# Altium schematic sheet S7CAS-PLEIADES-CARTE-MERE_P01_ETHERNET.SchDoc
size Tabloid; DocumentNumber: 5; SheetNumber: 5; SheetTotal: 17; Sheet_Name: ETHERNET; Size: 11x17
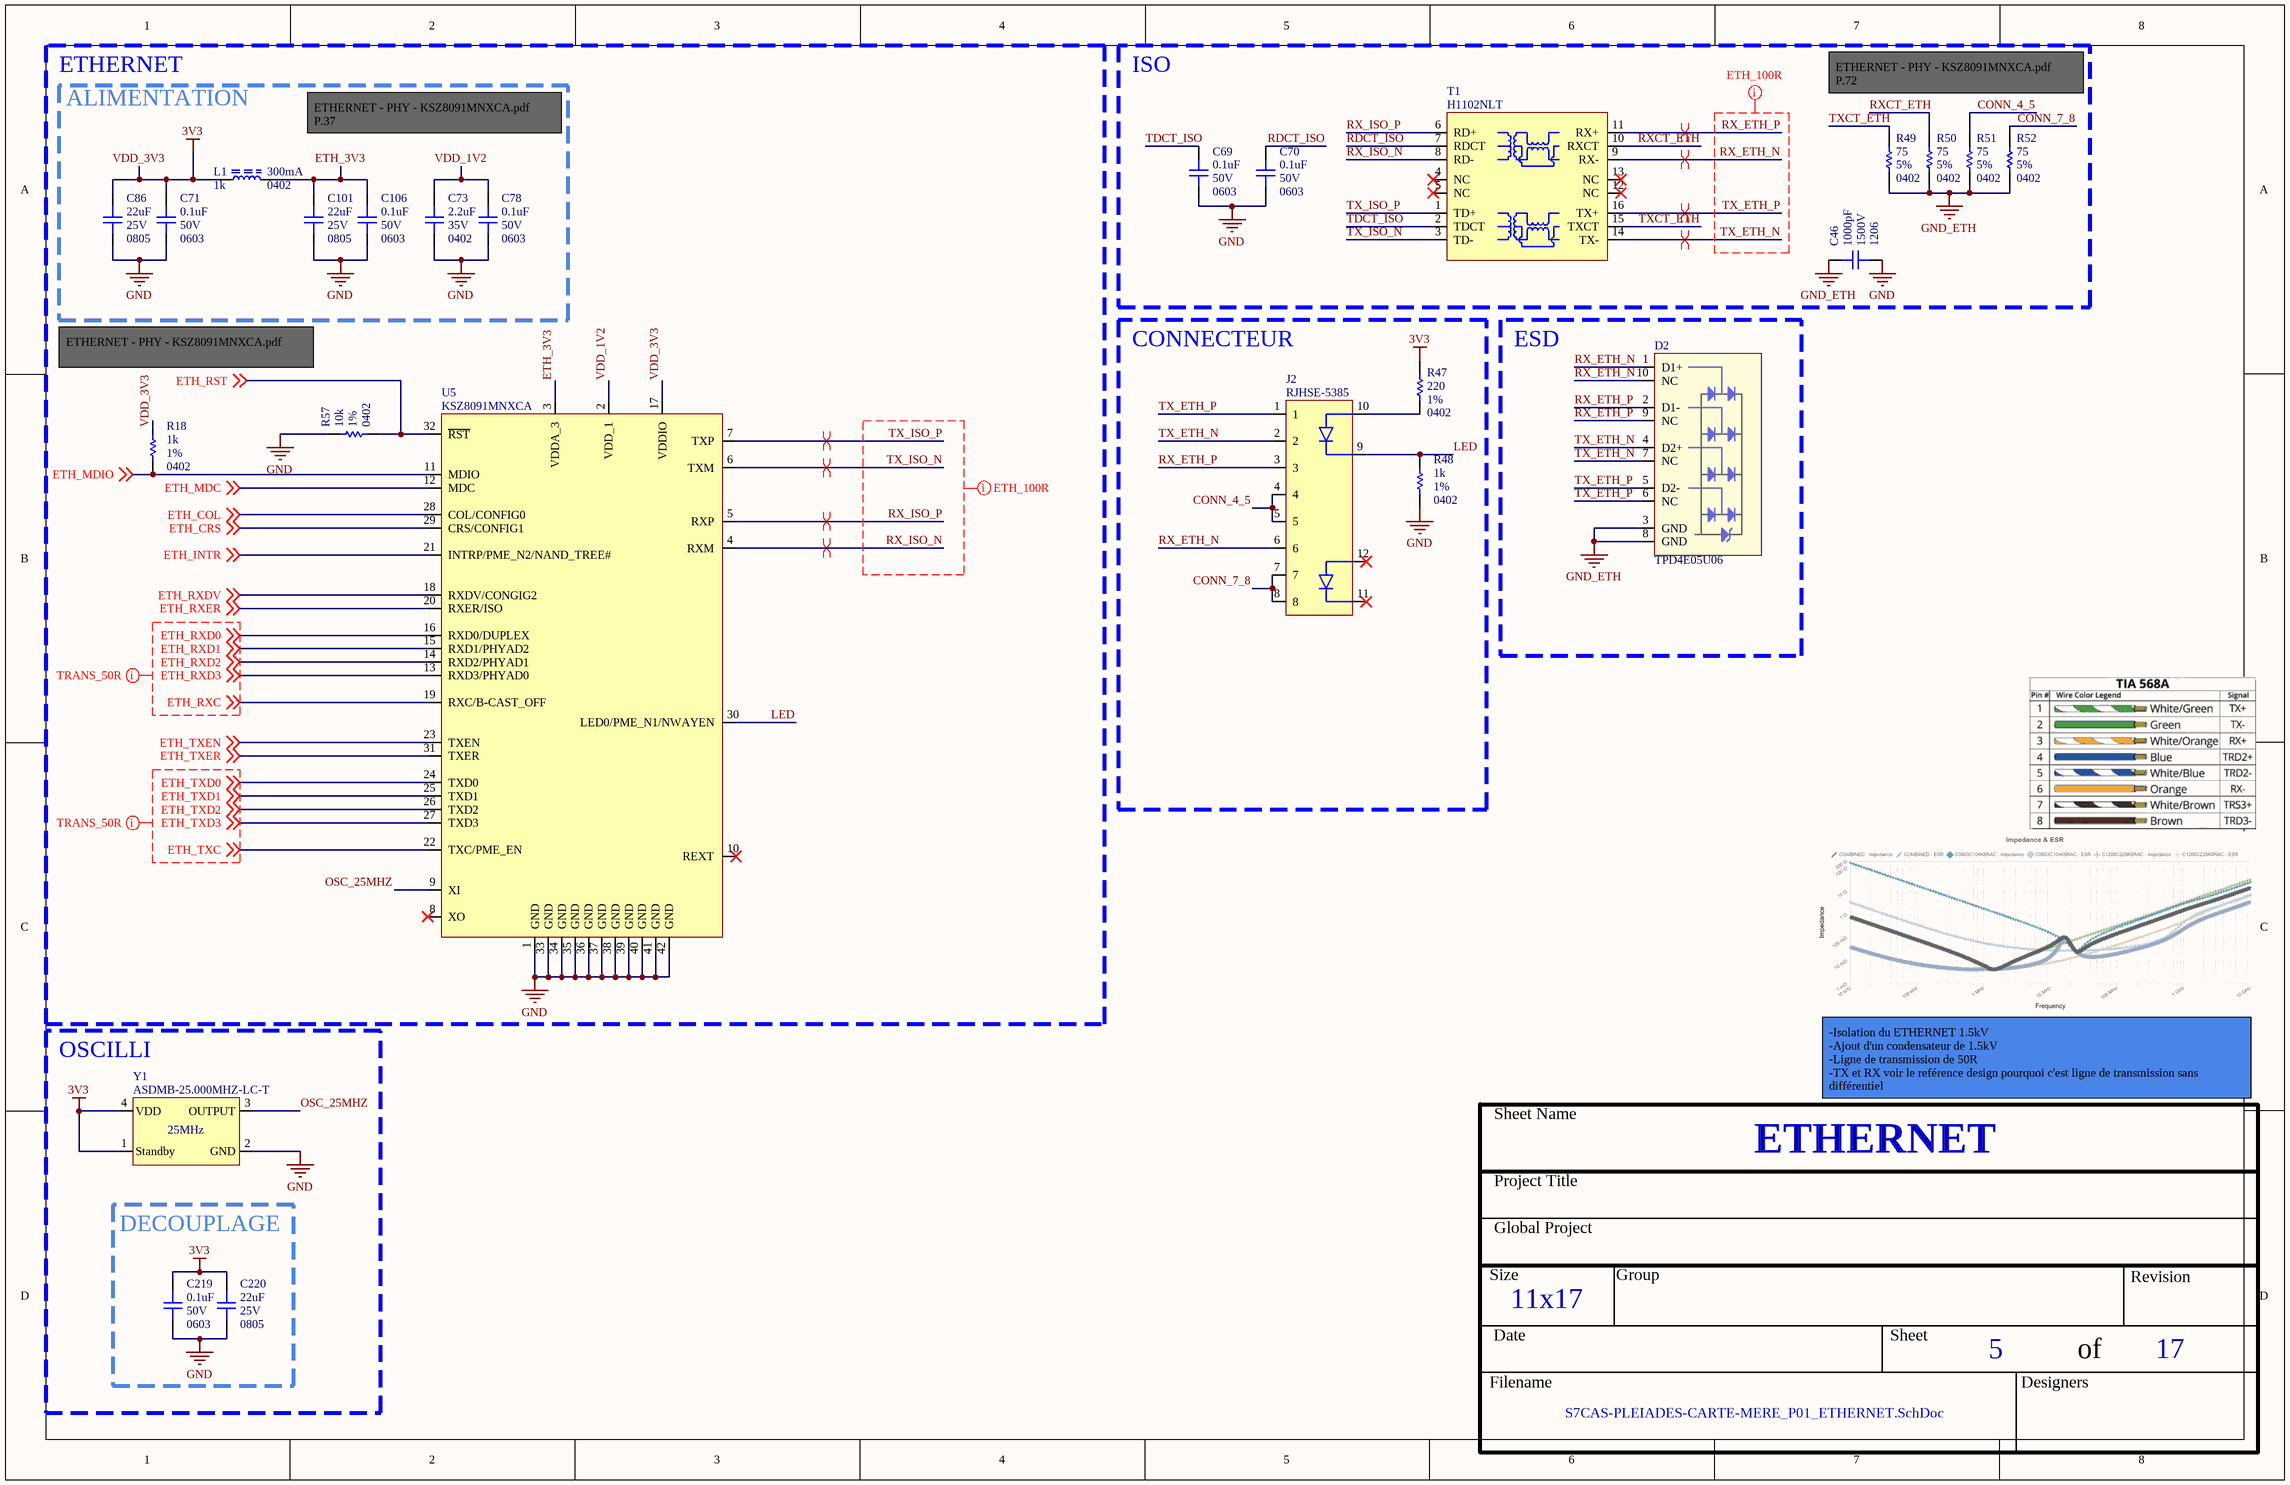
[diagram p0: S7CAS-PLEIADES-CARTE-MERE_P01_ETHERNET.SchDoc]

## Parts
C46  value 1000pF  Voltage: 1500V  Package: 1206  [CAP_1206]  (hidden comment: CAP - 1206)
C69  value 0.1uF  Voltage: 50V  Package: 0603  [CAP_0603]  (hidden comment: CAP - 0603)
C70  value 0.1uF  Voltage: 50V  Package: 0603  [CAP_0603]  (hidden comment: CAP - 0603)
C71  value 0.1uF  Voltage: 50V  Package: 0603  [CAP_0603]  (hidden comment: CAP - 0603)
C73  value 2.2uF  Voltage: 35V  Package: 0402  [CAP_0402]  (hidden comment: CAP - 0402)
C78  value 0.1uF  Voltage: 50V  Package: 0603  [CAP_0603]  (hidden comment: CAP - 0603)
C86  value 22uF  Voltage: 25V  Package: 0805  [CAP_0805]  (hidden comment: CAP - 0805)
C101  value 22uF  Voltage: 25V  Package: 0805  [CAP_0805]  (hidden comment: CAP - 0805)
C106  value 0.1uF  Voltage: 50V  Package: 0603  [CAP_0603]  (hidden comment: CAP - 0603)
C219  value 0.1uF  Voltage: 50V  Package: 0603  [CAP_0603]  (hidden comment: CAP - 0603)
C220  value 22uF  Voltage: 25V  Package: 0805  [CAP_0805]  (hidden comment: CAP - 0805)
D2  TPD4E05U06  [TVS_DATA_TPD4E05U06]
J2  RJHSE-5385  [CONN_ETHERNET_RJHSE-5385]
L1  value 1k  Current: 300mA  Package: 0402  [FER_0402]  (hidden comment: FER - 0402)
R18  value 1k  Package: 0402  Precision: 1%  [RES_0402]  (hidden comment: RES - 0402)
R47  value 220  Package: 0402  Precision: 1%  [RES_0402]  (hidden comment: RES - 0402)
R48  value 1k  Package: 0402  Precision: 1%  [RES_0402]  (hidden comment: RES - 0402)
R49  value 75  Package: 0402  Precision: 5%  [RES_0402]  (hidden comment: RES - 0402)
R50  value 75  Package: 0402  Precision: 5%  [RES_0402]  (hidden comment: RES - 0402)
R51  value 75  Package: 0402  Precision: 5%  [RES_0402]  (hidden comment: RES - 0402)
R52  value 75  Package: 0402  Precision: 5%  [RES_0402]  (hidden comment: RES - 0402)
R57  value 10k  Package: 0402  Precision: 1%  [RES_0402]  (hidden comment: RES - 0402)
T1  H1102NLT  [TRANSFO_H1102NLT]
U5  KSZ8091MNXCA  [COM_ETH_PHY_KSZ8091MNXCA]
Y1  ASDMB-25.000MHZ-LC-T  [OSC_ASDMB-25.000MHZ-LC-T]

## Blocks framed on the sheet
ISO: C46 C69 C70 R49-R52 T1
CONNECTEUR: J2 R47 R48
ESD: D2
OSCILLI: Y1
DECOUPLAGE: C219 C220

## Nets
GND: C46.1 C69.1 C70.1 C71.1 C73.1 C78.1 C86.1 C101.1 C106.1 C219.1 C220.1 R48.1 R57.1 U5.1(GND) U5.33(GND) U5.34(GND) U5.35(GND) U5.36(GND) U5.37(GND) U5.38(GND) U5.39(GND) U5.40(GND) U5.41(GND) U5.42(GND) Y1.2(GND)
GND_ETH: C46.2 D2.3(GND) D2.8(GND) R49.1 R50.1 R51.1 R52.1
VDD_3V3: C71.2 C86.2 C219.2 C220.2 L1.2 R18.2 R47.2 U5.17(VDDIO) Y1.1(Standby) Y1.4(VDD)  [also labelled 3V3]
CONN_4_5: J2.4 J2.5 R51.2
CONN_7_8: J2.7 J2.8 R52.2
ETH_3V3: C101.2 C106.2 L1.1 U5.3(VDDA_3)
ETH_COL: U5.28(COL/CONFIG0) ; off-sheet ETH_COL
ETH_CRS: U5.29(CRS/CONFIG1) ; off-sheet ETH_CRS
ETH_INTR: U5.21(INTRP/PME_N2/NAND_TREE#) ; off-sheet ETH_INTR
ETH_MDC: U5.12(MDC) ; off-sheet ETH_MDC
ETH_MDIO: R18.1 U5.11(MDIO) ; off-sheet ETH_MDIO
ETH_RST: R57.2 U5.32(~{RST}) ; off-sheet ETH_RST
ETH_RXC: U5.19(RXC/B-CAST_OFF) ; off-sheet ETH_RXC
ETH_RXD0: U5.16(RXD0/DUPLEX) ; off-sheet ETH_RXD0
ETH_RXD1: U5.15(RXD1/PHYAD2) ; off-sheet ETH_RXD1
ETH_RXD2: U5.14(RXD2/PHYAD1) ; off-sheet ETH_RXD2
ETH_RXD3: U5.13(RXD3/PHYAD0) ; off-sheet ETH_RXD3
ETH_RXDV: U5.18(RXDV/CONGIG2) ; off-sheet ETH_RXDV
ETH_RXER: U5.20(RXER/ISO) ; off-sheet ETH_RXER
ETH_TXC: U5.22(TXC/PME_EN) ; off-sheet ETH_TXC
ETH_TXD0: U5.24(TXD0) ; off-sheet ETH_TXD0
ETH_TXD1: U5.25(TXD1) ; off-sheet ETH_TXD1
ETH_TXD2: U5.26(TXD2) ; off-sheet ETH_TXD2
ETH_TXD3: U5.27(TXD3) ; off-sheet ETH_TXD3
ETH_TXEN: U5.23(TXEN) ; off-sheet ETH_TXEN
ETH_TXER: U5.31(TXER) ; off-sheet ETH_TXER
LED: J2.9(LED1_K) R48.2 U5.30(LED0/PME_N1/NWAYEN)
OSC_25MHZ: U5.9(XI) Y1.3(OUTPUT)
RDCT_ISO: C70.2 T1.7(RDCT)
RX_ETH_N: D2.1(D1+) D2.10(NC) J2.6 T1.9(RX-)
RX_ETH_P: D2.2(D1-) D2.9(NC) J2.3 T1.11(RX+)
RX_ISO_N: T1.8(RD-) U5.4(RXM)
RX_ISO_P: T1.6(RD+) U5.5(RXP)
RXCT_ETH: R50.2 T1.10(RXCT)
TDCT_ISO: C69.2 T1.2(TDCT)
TX_ETH_N: D2.4(D2+) D2.7(NC) J2.2 T1.14(TX-)
TX_ETH_P: D2.5(D2-) D2.6(NC) J2.1 T1.16(TX+)
TX_ISO_N: T1.3(TD-) U5.6(TXM)
TX_ISO_P: T1.1(TD+) U5.7(TXP)
TXCT_ETH: R49.2 T1.15(TXCT)
VDD_1V2: C73.2 C78.2 U5.2(VDD_1)
NetJ2_10: J2.10(LED1_A) R47.1

Not connected (* = marked no-connect by the designer): J2 11(LED2_K)* 12(LED2_A)*; T1 4(NC)* 5(NC)* 12(NC)* 13(NC)*; U5 8(XO)* 10(REXT)*

## Layout directives
net class ETH_100R: RX_ETH_N, RX_ETH_P, RX_ISO_N, RX_ISO_P, TX_ETH_N, TX_ETH_P, TX_ISO_N, TX_ISO_P
net class TRANS_50R; net class ETH_TRANS_50R: ETH_RXC, ETH_RXD0, ETH_RXD1, ETH_RXD2, ETH_RXD3, ETH_TXC, ETH_TXD0, ETH_TXD1, ETH_TXD2, ETH_TXD3
differential pair: RX_ETH_N, RX_ETH_P, RX_ISO_N, RX_ISO_P, TX_ETH_N, TX_ETH_P, TX_ISO_N, TX_ISO_P

## Notes on the sheet
- ETHERNET
- ETHERNET - PHY - KSZ8091MNXCA.pdf
  P.72
- ALIMENTATION
- ETHERNET - PHY - KSZ8091MNXCA.pdf
  P.37
- ETHERNET - PHY - KSZ8091MNXCA.pdf
- -Isolation du ETHERNET 1.5kV
  -Ajout d'un condensateur de 1.5kV
  -Ligne de transmission de 50R
  -TX et RX voir le reférence design pourquoi c'est ligne de transmission sans différentiel
- Sheet Name
- Project Title
- Global Project
- Size
- Group
- Revision
- Date
- Sheet
- of
- Filename
- Designers

## Library data of the parts
C46 = CAP - 1206: 1000 pF ±5% 1500V (1.5kV) Ceramic Capacitor C0G, NP0 1206 (3216 Metric); Mfg Part Number: VJ1206A102JXRAT5Z; Mfg: Vishay Vitramon; Current: *; CreatedBy: Jonathan Bouchard; Power: *; Precision: 5%; Part Number #1: VJ1206A102JXRAT5Z
C69-C71 C78 C106 C219 = CAP - 0603: 0.1 µF ±10% 50V Ceramic Capacitor X7R 0603 (1608 Metric); Mfg Part Number: C0603C104K5RACTU; Mfg: KEMET; Current: *; CreatedBy: Jonathan Bouchard; Power: *; Precision: 10%
C73 = CAP - 0402: 2.2 µF ±10% 35V Ceramic Capacitor X5R 0402 (1005 Metric); Mfg Part Number: GRM155R6YA225KE11D; Part Number #1: CL05A225KP5NSNC; Mfg: Murata Electronics; Current: *; CreatedBy: Jonathan Bouchard; Power: *; Precision: 10%
C86 C101 C220 = CAP - 0805: 22 µF ±20% 25V Ceramic Capacitor X5R 0805 (2012 Metric); Mfg Part Number: CL21A226MAYNNNE; Mfg: Samsung Electro-Mechanics; Current: *; CreatedBy: Jonathan Bouchard; Power: *; Precision: 20%
D2 = TVS_DATA_TPD4E05U06: TVS - TVS DIODE 5.5VWM 14VC - 10SON; Manufacturer #1: Texas Instruments; Part Number #1: TPD4E05U06DQAR; Current Rating: 2.5A (8/20µs); Power Max: 40 W (peak); Value: 4 unidirectionnal channels; Voltage rating: 6V (Breakdown); Polarized: YES; Magnetic Material: UNKNOWN; GRAMS Lib Spec: 2.8; Manufacturer #2: *; Part Number #2: *; HelpURL: http://www.ti.com/lit/ds/symlink/tpd4e05u06.pdf; Supplier 1: Digi-Key; Supplier Part Number 1: 296-35765-1-ND; Temperature: -40°C ~ 125°C; Package: 10-USON; CreatedBy/Date: Olivier Bernard / 12/3/2018; Tolerance: *; VerifiedBy: Caroline Paulin / 4 juillet 2018; Cryo: UNKNOWN; Mfg Part Number: TPD4E05U06DQAR
J2 = CONN_ETHERNET_RJHSE-5385: CONN - MOD JACK RJ45 R/A ETHERNET - TH; Mfg: Amphenol; Voltage: *; Current: *; Power: *; Mfg Part Number: RJHSE-5385; HelpURL: https://www.amphenolcanada.com/ProductSearch/drawings/AC/RJHSE538X.pdf; CreatedBy: Jonathan Bouchard; Temperature: -55°C ~ 85°C; Value: *; Precision: *; Package: TH-12; Supplier 1: Digikey; Supplier Part Number 1: RJHSE-5385-ND; Part Number #1: RJHSE-5385
L1 = FER - 0402: 1 kOhms @ 100 MHz 1 Ferrite Bead 0402 (1005 Metric) 300mA 650mOhm; Mfg Part Number: BLM15AG102SN1D; Mfg: Murata Electronics; Voltage: *; CreatedBy: Jonathan Bouchard; Power: *; Precision: *; Part Number #1: BLM15AG102SN1D
R18 R48 = RES - 0402: 1 kOhms ±1% 0.1W, 1/10W Chip Resistor 0402 (1005 Metric) Automotive AEC-Q200 Thick Film; Mfg Part Number: ERJ-2RKF1001X; Voltage: 50V; Mfg: Panasonic Electronic Components; Current: *; CreatedBy: Jonathan Bouchard; Power: 1/10W; Part Number #1: ERJ-2RKF1001X
R47 = RES - 0402: 220 Ohms ±1% 0.1W, 1/10W Chip Resistor 0402 (1005 Metric) Automotive AEC-Q200 Thick Film220; Mfg Part Number: ERJ-2RKF2200X; Voltage: 50V; Mfg: Panasonic Electronic Components; Current: *; CreatedBy: Jonathan Bouchard; Power: 1/10W; Part Number #1: ERJ-2RKF2200X
R49-R52 = RES - 0402: 75 Ohms ±5% 0.063W, 1/16W Chip Resistor 0402 (1005 Metric) Moisture Resistant Thick Film; Mfg Part Number: RC0402JR-0775RL; Voltage: 50V; Mfg: YAGEO; Current: *; CreatedBy: Jonathan Bouchard; Power: 1/16W; Part Number #1: RC0402JR-0775RL
R57 = RES - 0402: 10 kOhms ±1% 0.063W, 1/16W Chip Resistor 0402 (1005 Metric) Automotive AEC-Q200 Thick Film; Mfg Part Number: RMCF0402FT10K0; Voltage: 75V; Current: *; CreatedBy: Jonathan Bouchard; Power: 1/16W; Part Number #1: RMCF0402FT10K0
T1 = TRANSFO_H1102NLT: TRANSFO - ETHERNET 10/100B-TX - SMD-16; Mfg: Pulse Eng.; Value: 1:1 (350uH); Voltage: *; Current: *; Power: *; Mfg Part Number: H1102NLT; HelpURL: http://media.digikey.com/pdf/Data%20Sheets/Pulse%20PDFs/10_100BASE-T%20Single%20Port%20SMD%20Magnetics_Rev2008.pdf; CreatedBy: Jonathan Bouchard; Temperature: -40°C to 85°C; Precision: *; Package: SMD-16; Supplier 1: Digikey; Supplier Part Number 1: 553-1532-1-ND; Part Number #1: H1102NLT
U5 = COM_ETH_PHY_KSZ8091MNXCA: COM - ETHERNET PHY 10/100 - QFN-32; Voltage: 1.8V, 2.5V, 3.3V; Mfg: Micrel; Current: *; Power: *; Mfg Part Number: KSZ8091MNXCA; HelpURL: http://ww1.microchip.com/downloads/en/DeviceDoc/00002275A.pdf; CreatedBy: Jonathan Bouchard; Temperature: 0°C ~ 70°C; Value: *; Precision: *; Package: QFN-32; Supplier 1: Digikey; Supplier Part Number 1: 576-4356-ND; Part Number #1: KSZ8091MNXCA
Y1 = OSC_ASDMB-25.000MHZ-LC-T: OSC - 25MHz XO (Standard) LVCMOS - 4-SMD, No Lead; Manufacturer #1: Abracon LLC; Tolerance: ±50ppm; Voltage Rating: 1.8V ~ 3.3V; GRAMS Lib Spec: 2.8; Magnetic Material: Unknown; Polarized: Yes; Value: 25MHz; Current Rating: *; Power Max: *; HelpURL: https://abracon.com/Oscillators/ASDMB.pdf; CreatedBy/Date: Joël Lemay 2019-03-29; VerifiedBy: C. Paulin - 29 mai 2019; Temperature: -40°C ~ +85°C; Package: 4-SMD, No Lead; Manufacturer #2: *; Part Number #2: *; Part Number #1: ASDMB-25.000MHZ-LC-T; Supplier 1: Digi-Key; Supplier Part Number 1: 535-11730-1-ND; Cryo: UNKNOWN; Mfg Part Number: ASDMB-25.000MHZ-LC-T